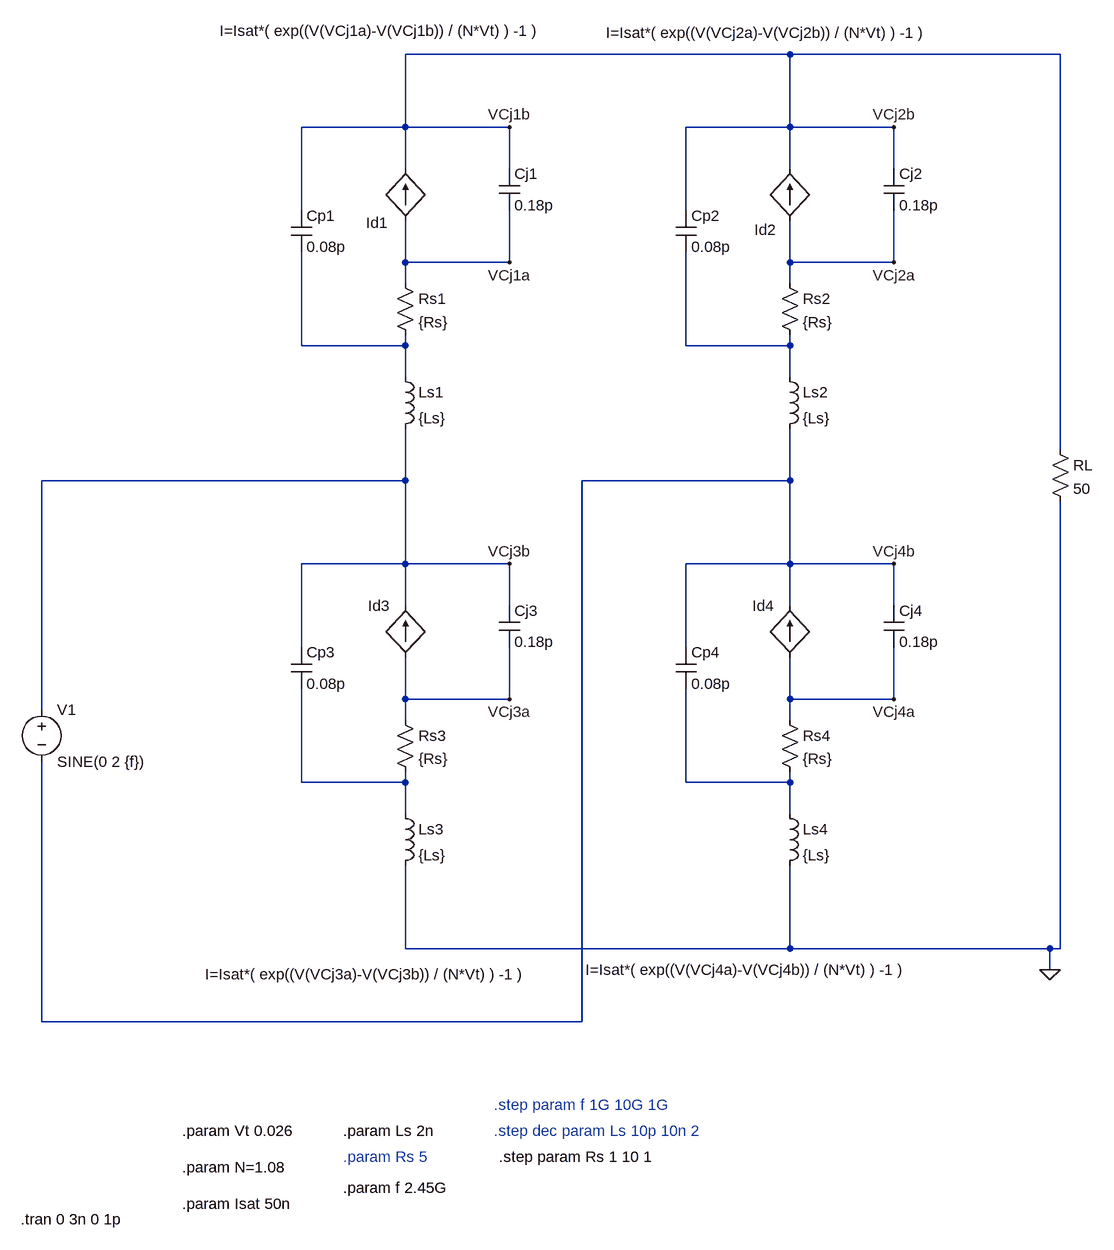
[diagram p0: schematic circ_equiv.asc]
circ_equiv.asc, the LTspice schematic file:
Version 4
SHEET 1 1020 1264
WIRE 544 -544 -48 -544
WIRE 960 -544 544 -544
WIRE -48 -432 -48 -544
WIRE -48 -432 -208 -432
WIRE 112 -432 -48 -432
WIRE 544 -432 544 -544
WIRE 544 -432 384 -432
WIRE 704 -432 544 -432
WIRE -48 -368 -48 -432
WIRE 112 -368 112 -432
WIRE 544 -368 544 -432
WIRE 704 -368 704 -432
WIRE -208 -304 -208 -432
WIRE 384 -304 384 -432
WIRE -48 -224 -48 -288
WIRE 112 -224 112 -304
WIRE 112 -224 -48 -224
WIRE 544 -224 544 -288
WIRE 704 -224 704 -304
WIRE 704 -224 544 -224
WIRE -48 -192 -48 -224
WIRE 544 -192 544 -224
WIRE -208 -96 -208 -240
WIRE -48 -96 -48 -112
WIRE -48 -96 -208 -96
WIRE 384 -96 384 -240
WIRE 544 -96 544 -112
WIRE 544 -96 384 -96
WIRE -48 -48 -48 -96
WIRE 544 -48 544 -96
WIRE 960 64 960 -544
WIRE -48 112 -48 32
WIRE -48 112 -608 112
WIRE 544 112 544 32
WIRE 544 112 224 112
WIRE -48 240 -48 112
WIRE -48 240 -208 240
WIRE 112 240 -48 240
WIRE 544 240 544 112
WIRE 544 240 384 240
WIRE 704 240 544 240
WIRE -48 304 -48 240
WIRE 112 304 112 240
WIRE 544 304 544 240
WIRE 704 304 704 240
WIRE -208 368 -208 240
WIRE 384 368 384 240
WIRE -48 448 -48 384
WIRE 112 448 112 368
WIRE 112 448 -48 448
WIRE 544 448 544 384
WIRE 704 448 704 368
WIRE 704 448 544 448
WIRE -608 464 -608 112
WIRE -48 480 -48 448
WIRE 544 480 544 448
WIRE -208 576 -208 432
WIRE -48 576 -48 560
WIRE -48 576 -208 576
WIRE 384 576 384 432
WIRE 544 576 544 560
WIRE 544 576 384 576
WIRE -48 624 -48 576
WIRE 544 624 544 576
WIRE -48 832 -48 704
WIRE 544 832 544 704
WIRE 544 832 -48 832
WIRE 944 832 544 832
WIRE 960 832 960 144
WIRE 960 832 944 832
WIRE 944 864 944 832
WIRE -608 944 -608 544
WIRE 224 944 224 112
WIRE 224 944 -608 944
FLAG 112 -224 VCj1a
FLAG 112 -432 VCj1b
FLAG 704 -224 VCj2a
FLAG 704 -432 VCj2b
FLAG 112 240 VCj3b
FLAG 112 448 VCj3a
FLAG 704 240 VCj4b
FLAG 704 448 VCj4a
FLAG 944 864 0
SYMBOL ind -64 -64 R0
SYMATTR InstName Ls1
SYMATTR Value {Ls}
SYMBOL res -64 -208 R0
SYMATTR InstName Rs1
SYMATTR Value {Rs}
SYMBOL cap -224 -304 R0
SYMATTR InstName Cp1
SYMATTR Value 0.08p
SYMBOL cap 96 -368 R0
SYMATTR InstName Cj1
SYMATTR Value 0.18p
SYMBOL bi -48 -288 R180
WINDOW 0 27 -3 Left 2
WINDOW 3 -209 292 Left 2
SYMATTR InstName Id1
SYMATTR Value I=Isat*( exp((V(VCj1a)-V(VCj1b)) / (N*Vt) ) -1 )
SYMBOL ind 528 -64 R0
SYMATTR InstName Ls2
SYMATTR Value {Ls}
SYMBOL res 528 -208 R0
SYMATTR InstName Rs2
SYMATTR Value {Rs}
SYMBOL cap 368 -304 R0
SYMATTR InstName Cp2
SYMATTR Value 0.08p
SYMBOL cap 688 -368 R0
SYMATTR InstName Cj2
SYMATTR Value 0.18p
SYMBOL bi 544 -288 R180
WINDOW 0 21 -14 Left 2
WINDOW 3 -212 289 Left 2
SYMATTR InstName Id2
SYMATTR Value I=Isat*( exp((V(VCj2a)-V(VCj2b)) / (N*Vt) ) -1 )
SYMBOL ind -64 608 R0
SYMATTR InstName Ls3
SYMATTR Value {Ls}
SYMBOL res -64 464 R0
SYMATTR InstName Rs3
SYMATTR Value {Rs}
SYMBOL cap -224 368 R0
SYMATTR InstName Cp3
SYMATTR Value 0.08p
SYMBOL cap 96 304 R0
SYMATTR InstName Cj3
SYMATTR Value 0.18p
SYMBOL bi -48 384 R180
WINDOW 0 24 80 Left 2
WINDOW 3 -187 -487 Left 2
SYMATTR InstName Id3
SYMATTR Value I=Isat*( exp((V(VCj3a)-V(VCj3b)) / (N*Vt) ) -1 )
SYMBOL ind 528 608 R0
SYMATTR InstName Ls4
SYMATTR Value {Ls}
SYMBOL res 528 464 R0
SYMATTR InstName Rs4
SYMATTR Value {Rs}
SYMBOL cap 368 368 R0
SYMATTR InstName Cp4
SYMATTR Value 0.08p
SYMBOL cap 688 304 R0
SYMATTR InstName Cj4
SYMATTR Value 0.18p
SYMBOL bi 544 384 R180
WINDOW 0 24 80 Left 2
WINDOW 3 -180 -480 Left 2
SYMATTR InstName Id4
SYMATTR Value I=Isat*( exp((V(VCj4a)-V(VCj4b)) / (N*Vt) ) -1 )
SYMBOL voltage -608 448 R0
WINDOW 123 0 0 Left 2
WINDOW 39 0 0 Left 2
SYMATTR InstName V1
SYMATTR Value SINE(0 2 {f})
SYMBOL res 944 48 R0
SYMATTR InstName RL
SYMATTR Value 50
TEXT -392 1112 Left 2 !.param Vt 0.026
TEXT -392 1168 Left 2 !.param N=1.08
TEXT -392 1224 Left 2 !.param Isat 50n
TEXT -640 1248 Left 2 !.tran 0 3n 0 1p
TEXT -144 1112 Left 2 !.param Ls 2n
TEXT -144 1152 Left 2 ;.param Rs 5
TEXT -144 1200 Left 2 !.param f 2.45G
TEXT 88 1112 Left 2 ;.step dec param Ls 10p 10n 2
TEXT 96 1152 Left 2 !.step param Rs 1 10 1
TEXT 88 1072 Left 2 ;.step param f 1G 10G 1G

The netlist it stands for:
* circ_equiv.asc
Ls1 N001 VCj3b {Ls}
Rs1 VCj1a N001 {Rs}
Cp1 VCj2b N001 0.08p
Cj1 VCj2b VCj1a 0.18p
B§Id1 VCj1a VCj2b I=Isat*( exp((V(VCj1a)-V(VCj1b)) / (N*Vt) ) -1 )
Ls2 N002 VCj4b {Ls}
Rs2 VCj2a N002 {Rs}
Cp2 VCj2b N002 0.08p
Cj2 VCj2b VCj2a 0.18p
B§Id2 VCj2a VCj2b I=Isat*( exp((V(VCj2a)-V(VCj2b)) / (N*Vt) ) -1 )
Ls3 N003 0 {Ls}
Rs3 VCj3a N003 {Rs}
Cp3 VCj3b N003 0.08p
Cj3 VCj3b VCj3a 0.18p
B§Id3 VCj3a VCj3b I=Isat*( exp((V(VCj3a)-V(VCj3b)) / (N*Vt) ) -1 )
Ls4 N004 0 {Ls}
Rs4 VCj4a N004 {Rs}
Cp4 VCj4b N004 0.08p
Cj4 VCj4b VCj4a 0.18p
B§Id4 VCj4a VCj4b I=Isat*( exp((V(VCj4a)-V(VCj4b)) / (N*Vt) ) -1 )
V1 VCj3b VCj4b SINE(0 2 {f})
RL VCj2b 0 50
.param Vt 0.026
.param N=1.08
.param Isat 50n
.tran 0 3n 0 1p
.param Ls 2n
* .param Rs 5
.param f 2.45G
* .step dec param Ls 10p 10n 2
.step param Rs 1 10 1
* .step param f 1G 10G 1G
.backanno
.end